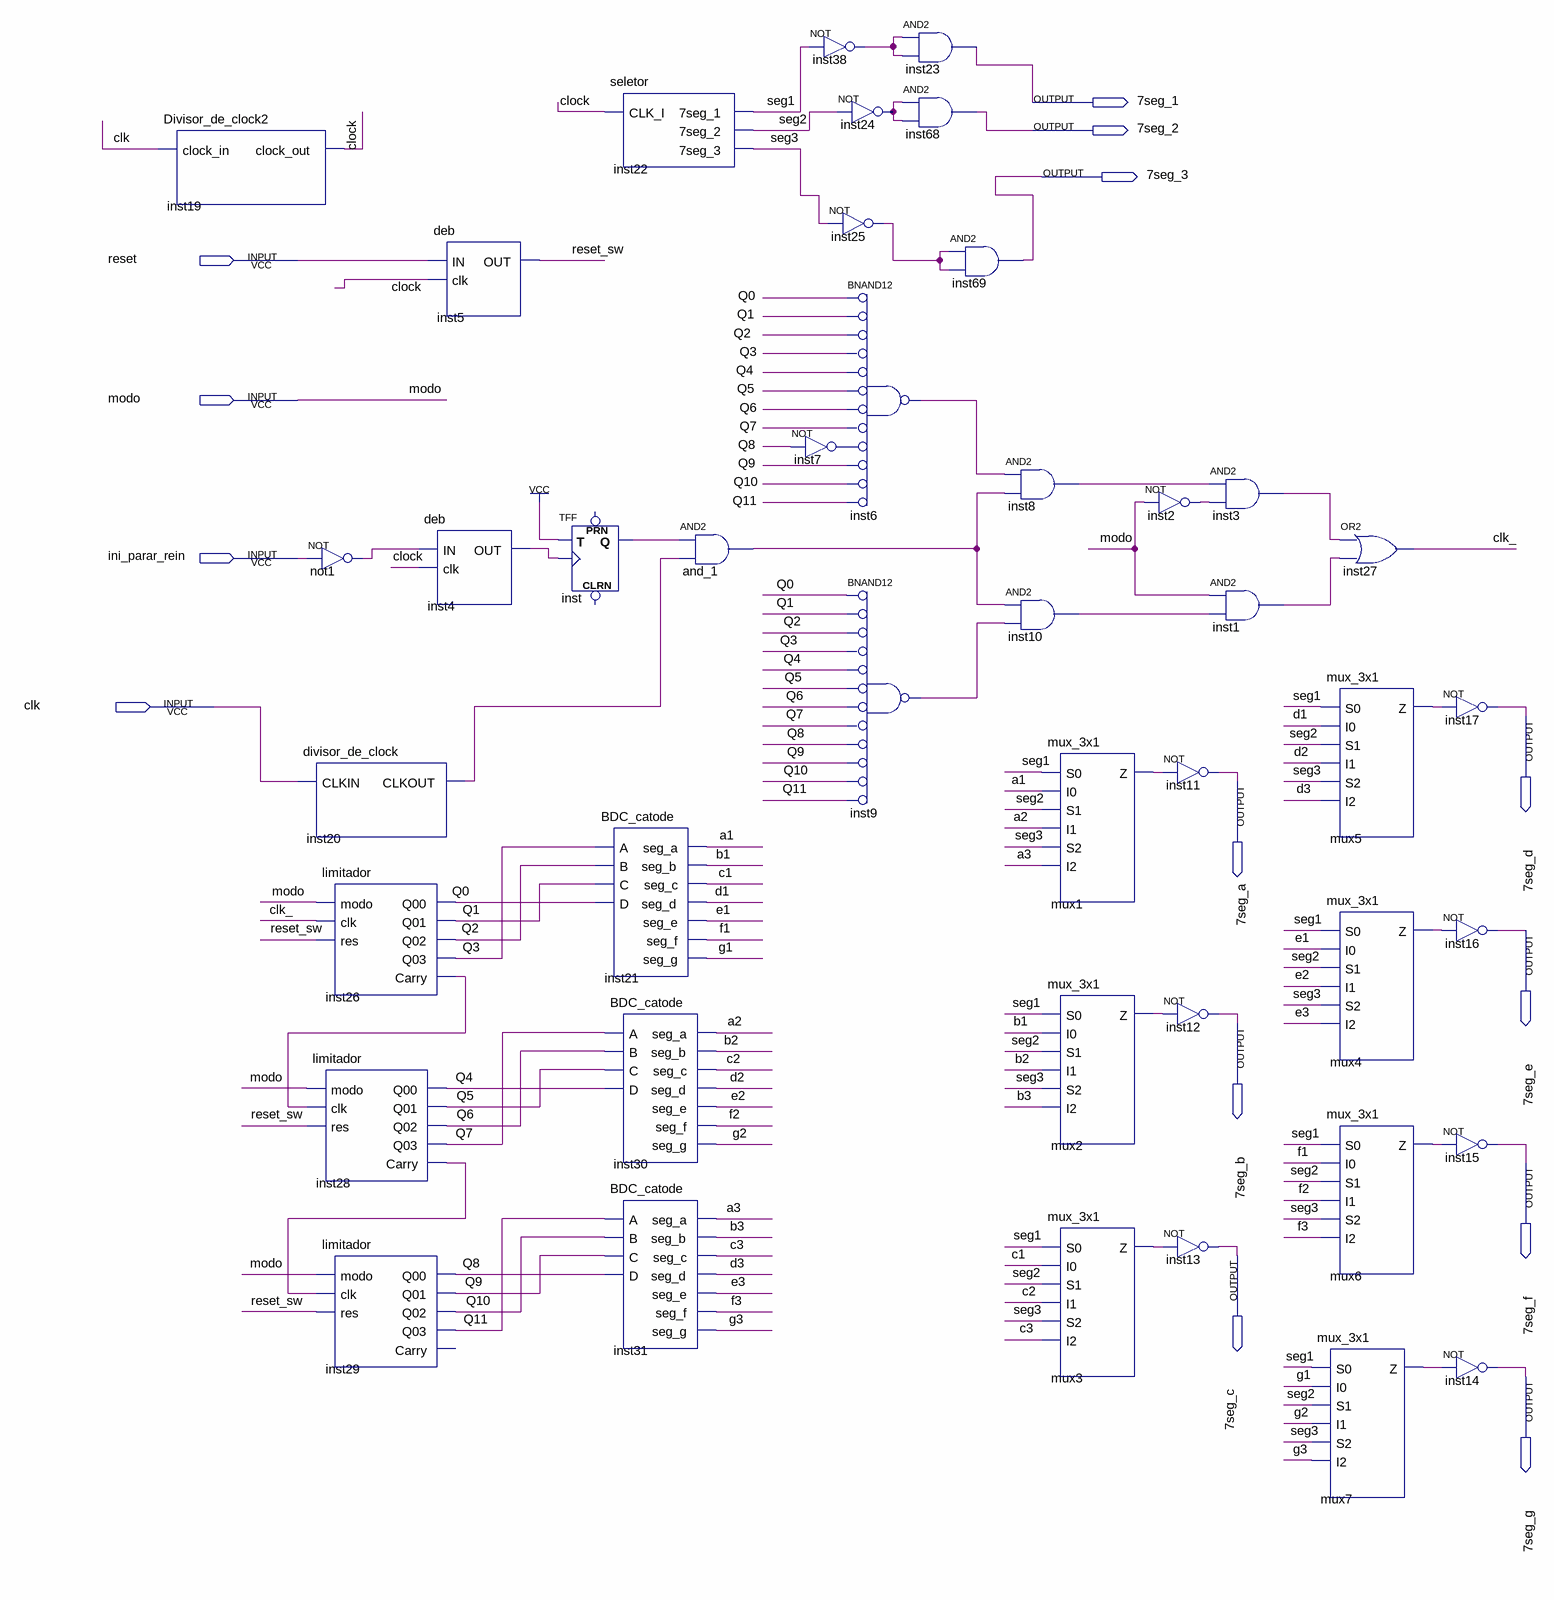
[diagram p0: schematic sheet]
// Quartus schematic Projeto1.bdf as structural Verilog: 43 symbols, 14 pins
module Projeto1 (
  input  reset,
  input  modo,
  input  ini_parar_rein,
  input  clk,
  output \7seg_1 ,
  output \7seg_2 ,
  output \7seg_3 ,
  output \7seg_d ,
  output \7seg_a ,
  output \7seg_e ,
  output \7seg_b ,
  output \7seg_f ,
  output \7seg_c ,
  output \7seg_g 
);

  wire a1, a2, a3, and_1_out, b1, b2, b3, c1, c2, c3, clk_, clock, d1, d2, d3, e1, e2, e3, f1, f2, f3, g1,
       g2, g3, inst1_out, inst2_out, inst3_out, inst4_out, inst6_out, inst7_out, inst8_out, inst9_out,
       inst10_out, inst20_clkout, inst24_out, inst25_out, inst26_carry, inst28_carry, inst38_out, inst_q,
       mux1_z, mux2_z, mux3_z, mux4_z, mux5_z, mux6_z, mux7_z, not1_out, Q0, Q1, Q2, Q3, Q4, Q5, Q6, Q7, Q8,
       Q9, Q10, Q11, reset_sw, seg1, seg2, seg3;

  Divisor_de_clock2 inst19 (.clock_in(clk), .clock_out(clock));
  not not1 (not1_out, ini_parar_rein);
  divisor_de_clock inst20 (.CLKIN(clk), .CLKOUT(inst20_clkout));
  limitador inst26 (
    .modo(modo), .clk(clk_), .res(reset_sw), .Q00(Q0), .Q01(Q1), .Q02(Q2), .Q03(Q3), .Carry(inst26_carry));
  limitador inst28 (
    .modo(modo), .clk(inst26_carry), .res(reset_sw), .Q00(Q4), .Q01(Q5), .Q02(Q6), .Q03(Q7),
    .Carry(inst28_carry));
  limitador inst29 (
    .modo(modo), .clk(inst28_carry), .res(reset_sw), .Q00(Q8), .Q01(Q9), .Q02(Q10), .Q03(Q11));  // open: Carry
  deb inst5 (.IN(reset), .clk(clock), .OUT(reset_sw));
  deb inst4 (.IN(not1_out), .clk(clock), .OUT(inst4_out));
  seletor inst22 (.CLK_I(clock), .\7seg_1 (seg1), .\7seg_2 (seg2), .\7seg_3 (seg3));
  TFF inst (.T(1'b1), .CLK(inst4_out), .Q(inst_q));  // open: PRN, CLRN
  BDC_catode inst21 (
    .A(Q3), .B(Q2), .C(Q1), .D(Q0), .seg_a(a1), .seg_b(b1), .seg_c(c1), .seg_d(d1), .seg_e(e1), .seg_f(f1),
    .seg_g(g1));
  BDC_catode inst30 (
    .A(Q7), .B(Q6), .C(Q5), .D(Q4), .seg_a(a2), .seg_b(b2), .seg_c(c2), .seg_d(d2), .seg_e(e2), .seg_f(f2),
    .seg_g(g2));
  BDC_catode inst31 (
    .A(Q11), .B(Q10), .C(Q9), .D(Q8), .seg_a(a3), .seg_b(b3), .seg_c(c3), .seg_d(d3), .seg_e(e3), .seg_f(f3),
    .seg_g(g3));
  and and_1 (and_1_out, inst_q, inst20_clkout);
  not inst38 (inst38_out, seg1);
  not inst24 (inst24_out, seg2);
  not inst25 (inst25_out, seg3);
  nand inst6 (inst6_out, ~Q0, ~Q1, ~Q2, ~Q3, ~Q4, ~Q5, ~Q6, ~Q7, ~inst7_out, ~Q9, ~Q10, ~Q11);  // BNAND12
  not inst7 (inst7_out, Q8);
  nand inst9 (inst9_out, ~Q0, ~Q1, ~Q2, ~Q3, ~Q4, ~Q5, ~Q6, ~Q7, ~Q8, ~Q9, ~Q10, ~Q11);  // BNAND12
  and inst23 (\7seg_1 , inst38_out, inst38_out);
  and inst68 (\7seg_2 , inst24_out, inst24_out);
  and inst69 (\7seg_3 , inst25_out, inst25_out);
  and inst8 (inst8_out, inst6_out, and_1_out);
  and inst10 (inst10_out, and_1_out, inst9_out);
  mux_3x1 mux1 (.S0(seg1), .I0(a1), .S1(seg2), .I1(a2), .S2(seg3), .I2(a3), .Z(mux1_z));
  mux_3x1 mux2 (.S0(seg1), .I0(b1), .S1(seg2), .I1(b2), .S2(seg3), .I2(b3), .Z(mux2_z));
  mux_3x1 mux3 (.S0(seg1), .I0(c1), .S1(seg2), .I1(c2), .S2(seg3), .I2(c3), .Z(mux3_z));
  not inst2 (inst2_out, modo);
  and inst3 (inst3_out, inst8_out, inst2_out);
  and inst1 (inst1_out, modo, inst10_out);
  not inst11 (\7seg_a , mux1_z);
  not inst12 (\7seg_b , mux2_z);
  not inst13 (\7seg_c , mux3_z);
  or inst27 (clk_, inst3_out, inst1_out);
  mux_3x1 mux5 (.S0(seg1), .I0(d1), .S1(seg2), .I1(d2), .S2(seg3), .I2(d3), .Z(mux5_z));
  mux_3x1 mux4 (.S0(seg1), .I0(e1), .S1(seg2), .I1(e2), .S2(seg3), .I2(e3), .Z(mux4_z));
  mux_3x1 mux6 (.S0(seg1), .I0(f1), .S1(seg2), .I1(f2), .S2(seg3), .I2(f3), .Z(mux6_z));
  mux_3x1 mux7 (.S0(seg1), .I0(g1), .S1(seg2), .I1(g2), .S2(seg3), .I2(g3), .Z(mux7_z));
  not inst17 (\7seg_d , mux5_z);
  not inst16 (\7seg_e , mux4_z);
  not inst15 (\7seg_f , mux6_z);
  not inst14 (\7seg_g , mux7_z);
endmodule
